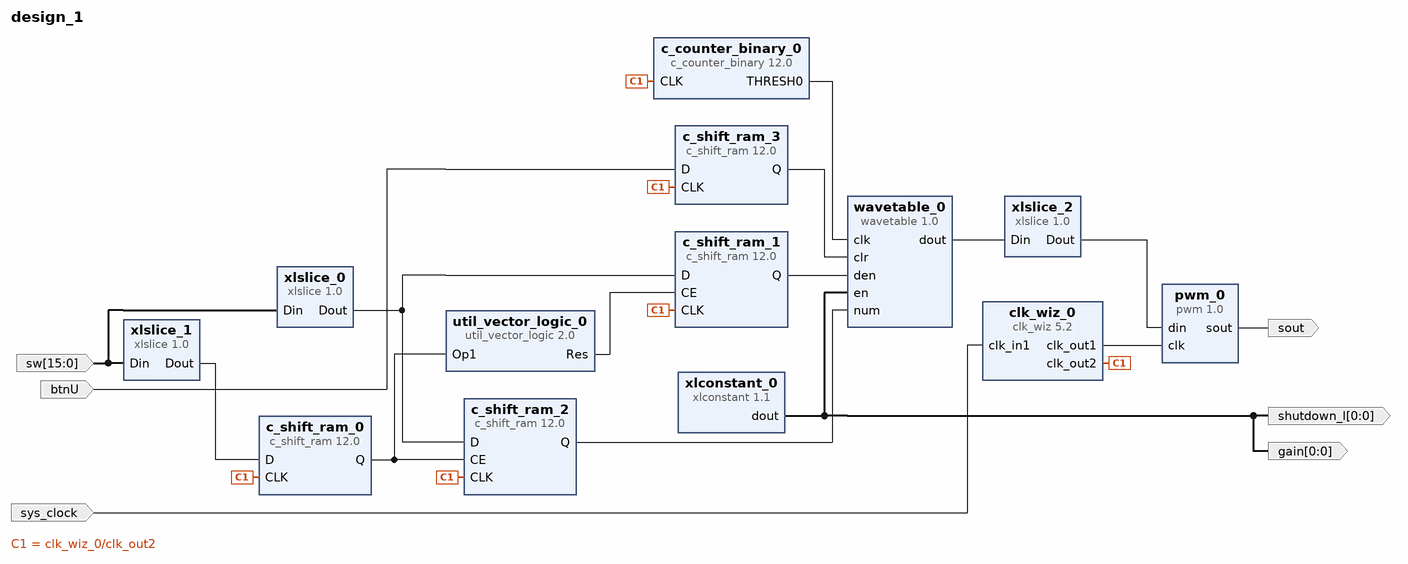
[diagram p0: block diagram of the top level]
# Vivado block design design_1, Vivado 2015.4
create_bd_design design_1

create_bd_port -dir I btnU
create_bd_port -dir O sout
create_bd_port -dir O -from 0 -to 0 gain
create_bd_port -dir O -from 0 -to 0 shutdown_l
create_bd_port -dir I -from 15 -to 0 -type data sw
create_bd_port -dir I -type clk sys_clock

create_bd_cell -type ip -vlnv xilinx.com:ip:xlslice:1.0 xlslice_0
set_property -dict {CONFIG.DOUT_WIDTH 15 CONFIG.DIN_TO 1 CONFIG.DIN_FROM 15 CONFIG.DIN_WIDTH 16} [get_bd_cells xlslice_0]
create_bd_cell -type ip -vlnv xilinx.com:ip:c_shift_ram:12.0 c_shift_ram_0
set_property -dict {CONFIG.Width 1 CONFIG.Depth 1 CONFIG.DefaultData 0 CONFIG.AsyncInitVal 0} [get_bd_cells c_shift_ram_0]
create_bd_cell -type ip -vlnv xilinx.com:ip:util_vector_logic:2.0 util_vector_logic_0
set_property -dict {CONFIG.C_SIZE 1 CONFIG.C_OPERATION not} [get_bd_cells util_vector_logic_0]
create_bd_cell -type ip -vlnv xilinx.com:ip:xlslice:1.0 xlslice_1
set_property -dict {CONFIG.DIN_TO 0 CONFIG.DIN_FROM 0 CONFIG.DIN_WIDTH 16} [get_bd_cells xlslice_1]
create_bd_cell -type ip -vlnv xilinx.com:ip:clk_wiz:5.2 clk_wiz_0
set_property -dict [list \
  CONFIG.CLKOUT2_USED true \
  CONFIG.NUM_OUT_CLKS 2 \
  CONFIG.CLKOUT1_REQUESTED_OUT_FREQ 256 \
  CONFIG.CLKOUT2_REQUESTED_OUT_FREQ 10 \
  CONFIG.USE_LOCKED false \
  CONFIG.USE_RESET false \
  CONFIG.MMCM_DIVCLK_DIVIDE 5 \
  CONFIG.MMCM_CLKFBOUT_MULT_F 48.000 \
  CONFIG.MMCM_CLKOUT0_DIVIDE_F 3.750 \
  CONFIG.MMCM_CLKOUT1_DIVIDE 96 \
  CONFIG.CLKOUT1_JITTER 220.657 \
  CONFIG.CLKOUT1_PHASE_ERROR 301.601 \
  CONFIG.CLKOUT2_JITTER 372.827 \
  CONFIG.CLKOUT2_PHASE_ERROR 301.601 \
] [get_bd_cells clk_wiz_0]
create_bd_cell -type ip -vlnv xilinx.com:ip:c_shift_ram:12.0 c_shift_ram_1
set_property -dict [list \
  CONFIG.CE true \
  CONFIG.Width 15 \
  CONFIG.DefaultData 000000000000000 \
  CONFIG.AsyncInitVal 000000000000000 \
] [get_bd_cells c_shift_ram_1]
create_bd_cell -type ip -vlnv xilinx.com:ip:c_shift_ram:12.0 c_shift_ram_2
set_property -dict [list \
  CONFIG.CE true \
  CONFIG.Width 15 \
  CONFIG.DefaultData 000000000000000 \
  CONFIG.AsyncInitVal 000000000000000 \
] [get_bd_cells c_shift_ram_2]
create_bd_cell -type ip -vlnv xilinx.com:ip:xlslice:1.0 xlslice_2
set_property -dict {CONFIG.DOUT_WIDTH 8 CONFIG.DIN_TO 24 CONFIG.DIN_FROM 31 CONFIG.DIN_WIDTH 32} [get_bd_cells xlslice_2]
create_bd_cell -type ip -vlnv xilinx.com:ip:c_shift_ram:12.0 c_shift_ram_3
set_property -dict {CONFIG.Width 1 CONFIG.Depth 1 CONFIG.DefaultData 0 CONFIG.AsyncInitVal 0} [get_bd_cells c_shift_ram_3]
create_bd_cell -type ip -vlnv xilinx.com:ip:c_counter_binary:12.0 c_counter_binary_0
set_property -dict [list \
  CONFIG.Output_Width 4 \
  CONFIG.Restrict_Count true \
  CONFIG.Final_Count_Value 9 \
  CONFIG.Sync_Threshold_Output true \
  CONFIG.Threshold_Value 9 \
] [get_bd_cells c_counter_binary_0]
create_bd_cell -type ip -vlnv xilinx.com:ip:xlconstant:1.1 xlconstant_0
create_bd_cell -type ip -vlnv usu.edu:ECE3700:pwm:1.0 pwm_0
create_bd_cell -type ip -vlnv user.org:user:wavetable:1.0 wavetable_0

# ---- connections ----

connect_bd_net [get_bd_pins xlslice_1/Dout] [get_bd_pins c_shift_ram_0/D]
connect_bd_net [get_bd_pins clk_wiz_0/clk_out2] \
  [get_bd_pins c_shift_ram_0/CLK] [get_bd_pins c_shift_ram_1/CLK] [get_bd_pins c_shift_ram_2/CLK] \
  [get_bd_pins c_shift_ram_3/CLK] [get_bd_pins c_counter_binary_0/CLK]
connect_bd_net [get_bd_pins c_shift_ram_0/Q] [get_bd_pins util_vector_logic_0/Op1] [get_bd_pins c_shift_ram_2/CE]
connect_bd_net [get_bd_ports sw] [get_bd_pins xlslice_1/Din] [get_bd_pins xlslice_0/Din]
connect_bd_net [get_bd_pins xlslice_0/Dout] [get_bd_pins c_shift_ram_1/D] [get_bd_pins c_shift_ram_2/D]
connect_bd_net [get_bd_pins util_vector_logic_0/Res] [get_bd_pins c_shift_ram_1/CE]
connect_bd_net [get_bd_pins c_shift_ram_1/Q] [get_bd_pins wavetable_0/den]
connect_bd_net [get_bd_pins c_shift_ram_2/Q] [get_bd_pins wavetable_0/num]
connect_bd_net [get_bd_pins wavetable_0/dout] [get_bd_pins xlslice_2/Din]
connect_bd_net [get_bd_ports btnU] [get_bd_pins c_shift_ram_3/D]
connect_bd_net [get_bd_pins c_counter_binary_0/THRESH0] [get_bd_pins wavetable_0/clk]
connect_bd_net [get_bd_pins c_shift_ram_3/Q] [get_bd_pins wavetable_0/clr]
connect_bd_net [get_bd_pins xlconstant_0/dout] [get_bd_ports gain] [get_bd_ports shutdown_l] [get_bd_pins wavetable_0/en]
connect_bd_net [get_bd_pins xlslice_2/Dout] [get_bd_pins pwm_0/din]
connect_bd_net [get_bd_pins clk_wiz_0/clk_out1] [get_bd_pins pwm_0/clk]
connect_bd_net [get_bd_pins pwm_0/sout] [get_bd_ports sout]
connect_bd_net [get_bd_ports sys_clock] [get_bd_pins clk_wiz_0/clk_in1]

validate_bd_design
save_bd_design
